# Altium schematic sheet Procesador.SchDoc
size A4; SheetNumber: 5; SheetTotal: 5; SPICEModelCacheQBTRCJJJ: <root> / <DocumentId>QBTRCJJJ</DocumentId> / </root>
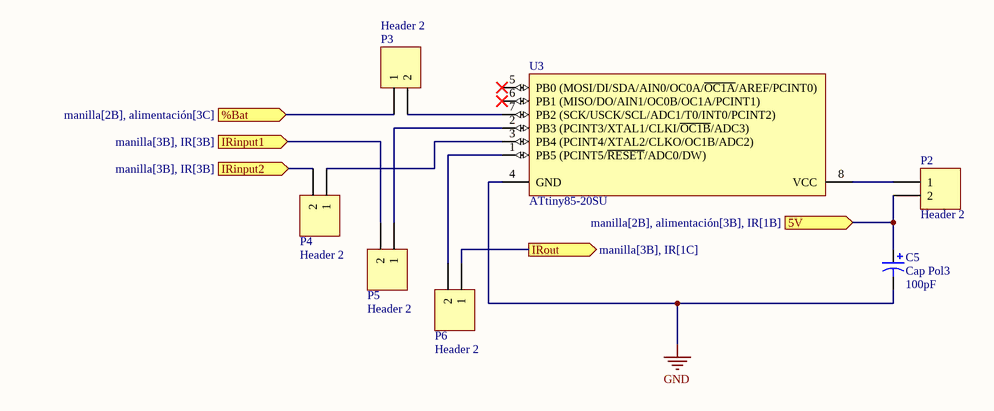
[diagram p0: Procesador.SchDoc]

## Parts
C5  Cap Pol3  value 100pF  [C0805]
P2  Header 2  [HDR1X2]
P3  Header 2  [HDR1X2]
P4  Header 2  [HDR1X2]
P5  Header 2  [HDR1X2]
P6  Header 2  [HDR1X2]
U3  ATtiny85-20SU  [8S2_M]

## Ports
5V (in, see manilla[2B], alimentación[3B], IR[1B]), %Bat (in, see manilla[2B], alimentación[3C]), IRinput1 (in, see manilla[3B], IR[3B]), IRinput2 (in, see manilla[3B], IR[3B]), IRout (out, see manilla[3B], IR[1C])

## Nets
GND: C5.2 U3.4(GND)
5V: C5.1 P2.2 ; port 5V
%Bat: P3.1 ; port %Bat
IRinput1: P5.2 ; port IRinput1
IRinput2: P4.2 ; port IRinput2
IRout: P6.1 ; port IRout
NetP2_1: P2.1 U3.8(VCC)
NetP3_2: P3.2 U3.7(PB2_(SCK/USCK/SCL/ADC1/T0/INT0/PCINT2))
NetP4_1: P4.1 U3.3(PB4_(PCINT4/XTAL2/CLKO/OC1B/ADC2))
NetP5_1: P5.1 U3.2(PB3_(PCINT3/XTAL1/CLKI/~{OC1B}/ADC3))
NetP6_2: P6.2 U3.1(PB5_(PCINT5/~{RESET}/ADC0/DW))

Not connected (* = marked no-connect by the designer): U3 5(PB0_(MOSI/DI/SDA/AIN0/OC0A/~{OC1A}/AREF/PCINT0))* 6(PB1_(MISO/DO/AIN1/OC0B/OC1A/PCINT1))*

## Library data of the parts
C5 = Cap Pol3: Polarized Capacitor (Surface Mount); Published: 8-Jun-2000; LatestRevisionDate: 29-May-2009; LatestRevisionNote: IPC-7351 Footprint Added.; PackageReference: C0805; Publisher: Altium Limited; PackageDescription: Chip Capacitor
P2-P6 = Header 2: Header, 2-Pin; LatestRevisionDate: 17-Jul-2002; LatestRevisionNote: Re-released for DXP Platform.; Publisher: Altium Limited
U3 = CMP-0093-00173-2: 8-bit AVR Microcontroller, 20MHz, 2.7-5.5V, 8K Flash, 512 Bytes EEPROM, 512 Bytes SRAM, Industrial Grade (-40°C to 85°C), 8-Lead SOIC, Pb-Free; ComponentLink3Description: ATtiny25/45/85 Summary; DatasheetVersion: revN, Apr-2011; PackageVersion: revF, Apr-2008; ComponentLink3URL: http://www.atmel.com/dyn/resources/prod_documents/2586S.pdf; ComponentLink1URL: http://www.atmel.com/; ComponentLink2Description: ATtiny25/45/85 Datasheet; RevisionNote: DatasheetVersion updated. URLs added.; PackageDescription: 8-Lead, 0.208" Body, Plastic Small Outline Package (EIAJ); ComponentLink1Description: Manufacturer URL; PackageReference: 8S2; ComponentLink2URL: http://www.atmel.com/dyn/resources/prod_documents/doc2586.pdf